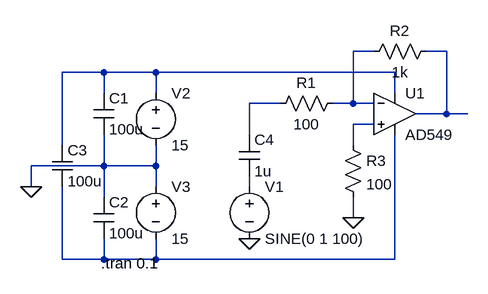
[diagram p0: schematic InvertingOpamp.asc]
InvertingOpamp.asc, the LTspice schematic file:
Version 4
SHEET 1 880 680
WIRE 192 80 160 80
WIRE 304 80 272 80
WIRE -224 112 -288 112
WIRE -144 112 -224 112
WIRE 224 112 -144 112
WIRE -224 144 -224 112
WIRE -144 144 -144 112
WIRE 224 144 224 112
WIRE 48 160 0 160
WIRE 160 160 160 80
WIRE 160 160 128 160
WIRE 192 160 160 160
WIRE 304 176 304 80
WIRE 304 176 256 176
WIRE 336 176 304 176
WIRE 192 192 160 192
WIRE 0 208 0 160
WIRE -288 224 -288 112
WIRE 160 224 160 192
WIRE -224 256 -224 208
WIRE -224 256 -336 256
WIRE -144 256 -144 224
WIRE -144 256 -224 256
WIRE -336 288 -336 256
WIRE -144 288 -144 256
WIRE 0 288 0 272
WIRE -224 304 -224 256
WIRE 160 336 160 304
WIRE -288 400 -288 288
WIRE -224 400 -224 368
WIRE -224 400 -288 400
WIRE -144 400 -144 368
WIRE -144 400 -224 400
WIRE 224 400 224 208
WIRE 224 400 -144 400
FLAG 160 336 0
FLAG -336 288 0
FLAG 0 368 0
SYMBOL Opamps\\AD549 224 112 R0
SYMATTR InstName U1
SYMBOL res 144 144 R90
WINDOW 0 0 56 VBottom 2
WINDOW 3 32 56 VTop 2
SYMATTR InstName R1
SYMATTR Value 100
SYMBOL res 288 64 R90
WINDOW 0 0 56 VBottom 2
WINDOW 3 32 56 VTop 2
SYMATTR InstName R2
SYMATTR Value 1k
SYMBOL voltage 0 272 R0
WINDOW 123 0 0 Left 0
WINDOW 39 0 0 Left 0
SYMATTR InstName V1
SYMATTR Value SINE(0 1 100)
SYMBOL voltage -144 128 R0
WINDOW 123 0 0 Left 0
WINDOW 39 0 0 Left 0
SYMATTR InstName V2
SYMATTR Value 15
SYMBOL voltage -144 272 R0
WINDOW 123 0 0 Left 0
WINDOW 39 0 0 Left 0
SYMATTR InstName V3
SYMATTR Value 15
SYMBOL cap -240 144 R0
SYMATTR InstName C1
SYMATTR Value 100u
SYMBOL cap -240 304 R0
SYMATTR InstName C2
SYMATTR Value 100u
SYMBOL cap -304 224 R0
SYMATTR InstName C3
SYMATTR Value 100u
SYMBOL res 144 208 R0
SYMATTR InstName R3
SYMATTR Value 100
SYMBOL cap -16 208 R0
SYMATTR InstName C4
SYMATTR Value 1u
TEXT -228 406 Left 2 !.tran 0.1

The netlist it stands for:
* InvertingOpamp.asc
XU1 N005 N001 N003 N007 N002 AD549  ; pins In+ In- V+ V- OUT
R1 N001 N004 100
R2 N002 N001 1k
V1 N006 0 SINE(0 1 100)
V2 N003 0 15
V3 0 N007 15
C1 N003 0 100u
C2 0 N007 100u
C3 N003 N007 100u
R3 N005 0 100
C4 N004 N006 1u
.tran 0.1
.backanno
.end